# EAGLE design hotmetal (EAGLE 7.7.0)
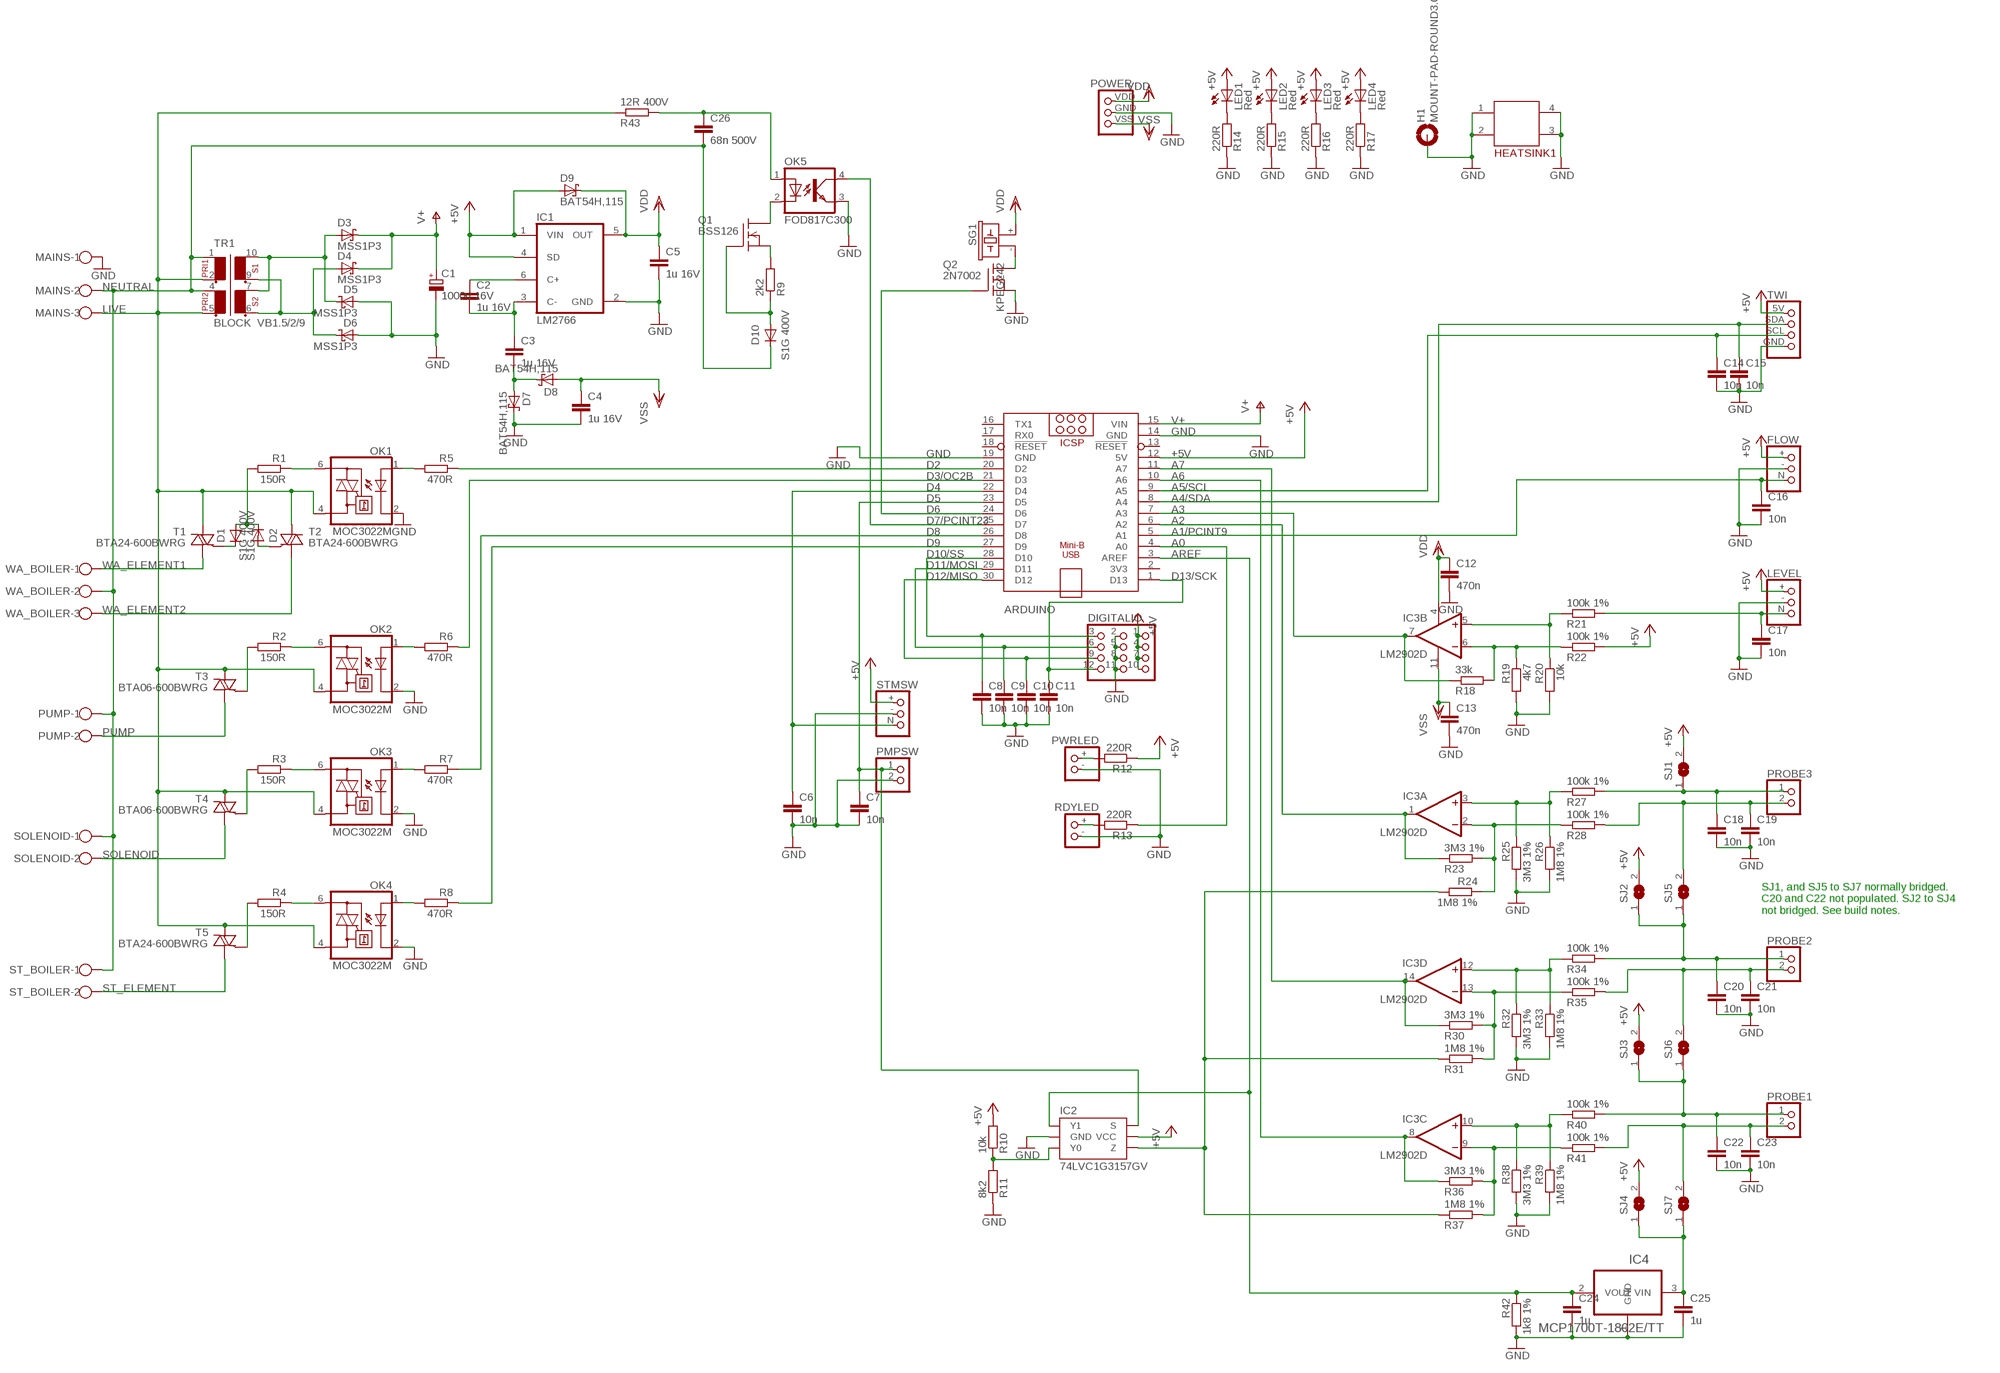
[diagram p0: schematic, sheet 1]

## Parts
ARDUINO  ARDUINO_NANO  [ARDUINO_NANO]
C1  1000u 16V  CPOL-EUE5-10.5  [E5-10,5]
C2  1u 16V  C-EUC0603K  [C0603K]
C3  1u 16V  C-EUC0603K  [C0603K]
C4  1u 16V  C-EUC0603K  [C0603K]
C5  1u 16V  C-EUC0603K  [C0603K]
C6  10n  C-EUC0603K  [C0603K]
C7  10n  C-EUC0603K  [C0603K]
C8  10n  C-EUC0603K  [C0603K]
C9  10n  C-EUC0603K  [C0603K]
C10  10n  C-EUC0603K  [C0603K]
C11  10n  C-EUC0603K  [C0603K]
C12  470n  C-EUC0603K  [C0603K]
C13  470n  C-EUC0603K  [C0603K]
C14  10n  C-EUC0603K  [C0603K]
C15  10n  C-EUC0603K  [C0603K]
C16  10n  C-EUC0603K  [C0603K]
C17  10n  C-EUC0603K  [C0603K]
C18  10n  C-EUC0603K  [C0603K]
C19  10n  C-EUC0603K  [C0603K]
C20  10n  C-EUC0603K  [C0603K]
C21  10n  C-EUC0603K  [C0603K]
C22  10n  C-EUC0603K  [C0603K]
C23  10n  C-EUC0603K  [C0603K]
C24  1u  C-EUC0603K  [C0603K]
C25  1u  C-EUC0603K  [C0603K]
C26  68n 500V  C-EUC1210K  [C1210K]
D1  S1G 400V  DIODE-DO214AC  [DO214AC]
D2  S1G 400V  DIODE-DO214AC  [DO214AC]
D3  MSS1P3  PD3S160  [POWERDI323]
D4  MSS1P3  PD3S160  [POWERDI323]
D5  MSS1P3  PD3S160  [POWERDI323]
D6  MSS1P3  PD3S160  [POWERDI323]
D7  BAT54H,115  [SOD123F]
D8  BAT54H,115  [SOD123F]
D9  BAT54H,115  [SOD123F]
D10  S1G 400V  DIODE-DO214AC  [DO214AC]
DIGITALIO  HDR4X3PWR  [HDR4X3PWR]
FLOW  HDR3PWR  [HDR3PWR]
H1  MOUNT-PAD-ROUND3.0  [3,0-PAD]
HEATSINK1  HOTMETALHEATSINK  [HOTMETALHEATSINK]
IC1  LM2766  [SOT23-6]
IC2  74LVC1G3157GV  [SOT457]
IC3  LM2902D  [SO14]
IC4  MCP1700T-1802E/TT  [SOT23]
LED1  Red  LEDSML0805  [SML0805]
LED2  Red  LEDSML0805  [SML0805]
LED3  Red  LEDSML0805  [SML0805]
LED4  Red  LEDSML0805  [SML0805]
LEVEL  HDR3PWR  [HDR3PWR]
MAINS  W237-103  [W237-103]
OK1  MOC3022M  [DIL06]
OK2  MOC3022M  [DIL06]
OK3  MOC3022M  [DIL06]
OK4  MOC3022M  [DIL06]
OK5  FOD817C300  PC817  [DIL04]
PMPSW  HDR2  [HDR2]
POWER  HDR3VDDVSS  [HDR2VDDVSS]
PROBE1  HDR2  [HDR2]
PROBE2  HDR2  [HDR2]
PROBE3  HDR2  [HDR2]
PUMP  W237-102  [W237-102]
PWRLED  HDR2PWR  [HDR2PWR]
Q1  BSS126  2N7002  [SOT23]
Q2  2N7002  [SOT23]
R1  150R  R-EU_0204/7  [0204/7]
R2  150R  R-EU_0204/7  [0204/7]
R3  150R  R-EU_0204/7  [0204/7]
R4  150R  R-EU_0204/7  [0204/7]
R5  470R  R-EU_R0805  [R0805]
R6  470R  R-EU_R0805  [R0805]
R7  470R  R-EU_R0805  [R0805]
R8  470R  R-EU_R0805  [R0805]
R9  2k2  R-EU_R0805  [R0805]
R10  10k  R-EU_R0805  [R0805]
R11  8k2  R-EU_R0805  [R0805]
R12  220R  R-EU_R0805  [R0805]
R13  220R  R-EU_R0805  [R0805]
R14  220R  R-EU_R0805  [R0805]
R15  220R  R-EU_R0805  [R0805]
R16  220R  R-EU_R0805  [R0805]
R17  220R  R-EU_R0805  [R0805]
R18  33k  R-EU_R0805  [R0805]
R19  4k7  R-EU_R0805  [R0805]
R20  10k  R-EU_R0805  [R0805]
R21  100k 1%  R-EU_R0805  [R0805]
R22  100k 1%  R-EU_R0805  [R0805]
R23  3M3 1%  R-EU_R0805  [R0805]
R24  1M8 1%  R-EU_R0805  [R0805]
R25  3M3 1%  R-EU_R0805  [R0805]
R26  1M8 1%  R-EU_R0805  [R0805]
R27  100k 1%  R-EU_R0805  [R0805]
R28  100k 1%  R-EU_R0805  [R0805]
R30  3M3 1%  R-EU_R0805  [R0805]
R31  1M8 1%  R-EU_R0805  [R0805]
R32  3M3 1%  R-EU_R0805  [R0805]
R33  1M8 1%  R-EU_R0805  [R0805]
R34  100k 1%  R-EU_R0805  [R0805]
R35  100k 1%  R-EU_R0805  [R0805]
R36  3M3 1%  R-EU_R0805  [R0805]
R37  1M8 1%  R-EU_R0805  [R0805]
R38  3M3 1%  R-EU_R0805  [R0805]
R39  1M8 1%  R-EU_R0805  [R0805]
R40  100k 1%  R-EU_R0805  [R0805]
R41  100k 1%  R-EU_R0805  [R0805]
R42  1k8 1%  R-EU_R0805  [R0805]
R43  12R 400V  R-EU_R0805  [R0805]
RDYLED  HDR2PWR  [HDR2PWR]
SG1  KPEG242  F/CM12P  [F/CM12P]
SJ1  SJ  [SJ]
SJ2  SJ  [SJ]
SJ3  SJ  [SJ]
SJ4  SJ  [SJ]
SJ5  SJ  [SJ]
SJ6  SJ  [SJ]
SJ7  SJ  [SJ]
SOLENOID  W237-102  [W237-102]
ST_BOILER  W237-102  [W237-102]
STMSW  HDR3PWR  [HDR3PWR]
T1  BTA24-600BWRG  BTA_TRIAC  [TO220FACEDOWN]
T2  BTA24-600BWRG  BTA_TRIAC  [TO220FACEDOWN]
T3  BTA06-600BWRG  BTA_TRIAC  [TO220FACEDOWN]
T4  BTA06-600BWRG  BTA_TRIAC  [TO220FACEDOWN]
T5  BTA24-600BWRG  BTA_TRIAC  [TO220FACEDOWN]
TR1  BLOCK VB1.5/2/9  TRAFO20X20MM2P2S  [T2P2S]
TWI  HDR4TWI  [HDR4TWI]
WA_BOILER  W237-103  [W237-103]

## Nets
+5V: ARDUINO.12(5V) D9.A DIGITALIO.1 DIGITALIO.4 DIGITALIO.7 DIGITALIO.10 FLOW.+ IC1.1(VIN) IC1.4(SD) IC2.5(VCC) LED1.A LED2.A LED3.A LED4.A LEVEL.+ R10.2 R12.1 R22.2 SJ1.2 SJ2.2 SJ3.2 SJ4.2 STMSW.+ TWI.5V
A0: ARDUINO.4(A0) R13.1
A1/PCINT9: ARDUINO.5(A1) C16.1 FLOW.N
A2: ARDUINO.6(A2) IC3.1(A:OUT) R23.1
A3: ARDUINO.7(A3) IC3.7(B:OUT) R18.1
A4/SDA: ARDUINO.8(A4) C15.1 TWI.SDA
A5/SCL: ARDUINO.9(A5) C14.1 TWI.SCL
A6: ARDUINO.10(A6) IC3.8(C:OUT) R36.1
A7: ARDUINO.11(A7) IC3.14(D:OUT) R30.1
AREF: ARDUINO.3(AREF) C24.1 IC2.1(Y1) IC4.2(VOUT) R42.1
D2: ARDUINO.20(D2) R5.1
D3/OC2B: ARDUINO.21(D3) R6.1
D4: ARDUINO.22(D4) C6.1 STMSW.N
D5: ARDUINO.23(D5) C7.1 IC2.6(S) PMPSW.1
D6: ARDUINO.24(D6) Q2.1(G)
D7/PCINT23: ARDUINO.25(D7) OK5.4(COL)
D8: ARDUINO.26(D8) R7.1
D9: ARDUINO.27(D9) R8.1
D10/SS: ARDUINO.28(D10) C8.1 DIGITALIO.3
D11/MOSI: ARDUINO.29(D11) C9.1 DIGITALIO.6
D12/MISO: ARDUINO.30(D12) C10.1 DIGITALIO.9
D13/SCK: ARDUINO.1(D13) C11.1 DIGITALIO.12
GND: ARDUINO.14(GND) ARDUINO.19(GND) C1.- C4.2 C5.2 C6.2 C7.2 C8.2 C9.2 C10.2 C11.2 C12.2 C13.2 C14.2 C15.2 C16.2 C17.2 C18.2 C19.2 C20.2 C21.2 C22.2 C23.2 C24.2 C25.2 D5.A D6.A D7.C DIGITALIO.2 DIGITALIO.5 DIGITALIO.8 DIGITALIO.11 FLOW.- H1.B3,0(MOUNT) HEATSINK1.1 HEATSINK1.2 HEATSINK1.3 HEATSINK1.4 IC1.2(GND) IC2.2(GND) IC4.1(GND) LEVEL.- MAINS.1 OK1.2(C) OK2.2(C) OK3.2(C) OK4.2(C) OK5.3(EMIT) PMPSW.2 POWER.GND PWRLED.- Q2.2(S) R11.1 R14.1 R15.1 R16.1 R17.1 R19.2 R20.2 R25.2 R26.2 R32.2 R33.2 R38.2 R39.2 R42.2 RDYLED.- STMSW.- TWI.GND
LIVE [power]: MAINS.3 OK1.4(A1) OK2.4(A1) OK3.4(A1) OK4.4(A1) R43.1 T1.T2(A2) T2.T2(A2) T3.T2(A2) T4.T2(A2) T5.T2(A2) TR1.2 TR1.5
N$1: OK3.1(A) R7.2
N$2: OK1.1(A) R5.2
N$3: OK4.1(A) R8.2
N$4 [power]: R3.2 T4.G
N$5 [power]: OK3.6(A2) R3.1
N$6 [power]: D1.A D2.C R1.2
N$7 [power]: R4.2 T5.G
N$8 [power]: OK4.6(A2) R4.1
N$9 [power]: OK1.6(A2) R1.1
N$10: C21.1 PROBE2.2 R35.2 SJ6.2
N$11: C22.1 PROBE1.1 R40.2 SJ3.1 SJ6.1
N$12: C20.1 PROBE2.1 R34.2 SJ2.1 SJ5.1
N$13: IC3.3(A:+IN) R25.1 R26.1 R27.1
N$14 [power]: D1.C T1.G
N$15 [power]: D2.A T2.G
N$16: C17.1 LEVEL.N R21.2
N$17: IC3.10(C:+IN) R38.1 R39.1 R40.1
N$18: IC3.9(C:-IN) R36.2 R37.2 R41.1
N$19: Q2.3(D) SG1.-
N$20: LED3.C R16.2
N$21: C2.1 IC1.6(C+)
N$22: OK2.1(A) R6.2
N$23 [power]: R2.2 T3.G
N$24 [power]: OK2.6(A2) R2.1
N$25: PWRLED.+ R12.2
N$26: R13.2 RDYLED.+
N$27: C2.2 C3.1 IC1.3(C-)
N$28: C23.1 PROBE1.2 R41.2 SJ7.2
N$29 [power]: C26.1 OK5.1(A) R43.2
N$30 [power]: D10.A Q1.1(G) R9.1
N$31: C19.1 PROBE3.2 R28.2 SJ5.2
N$32: C18.1 PROBE3.1 R27.2 SJ1.1
N$33: IC3.12(D:+IN) R32.1 R33.1 R34.1
N$34: IC3.2(A:-IN) R23.2 R24.1 R28.1
N$35: IC3.13(D:-IN) R30.2 R31.2 R35.1
N$36: IC3.5(B:+IN) R20.1 R21.1
N$37: IC2.3(Y0) R10.1 R11.2
N$38: IC2.4(Z) R24.2 R31.1 R37.1
N$39: D3.A D5.C TR1.7 TR1.10
N$40: IC3.6(B:-IN) R18.2 R19.1 R22.1
N$41: C25.1 IC4.3(VIN) SJ4.1 SJ7.1
N$42: LED1.C R14.2
N$43: LED2.C R15.2
N$44: LED4.C R17.2
N$45: D4.A D6.C TR1.6 TR1.9
N$46 [power]: Q1.2(S) R9.2
N$47 [power]: OK5.2(C) Q1.3(D)
N$49: C3.2 D7.A D8.C
NEUTRAL [power]: C26.2 D10.C MAINS.2 PUMP.1 SOLENOID.1 ST_BOILER.1 TR1.1 TR1.4 WA_BOILER.2
PUMP [power]: PUMP.2 T3.T1(A1)
SOLENOID [power]: SOLENOID.2 T4.T1(A1)
ST_ELEMENT [power]: ST_BOILER.2 T5.T1(A1)
V+: ARDUINO.15(VIN) C1.+ D3.C D4.C
VDD: C5.1 C12.1 D9.C IC1.5(OUT) IC3.4(P:V+) POWER.VDD SG1.+
VSS: C4.1 C13.1 D8.A IC3.11(P:V-) POWER.VSS
WA_ELEMENT1 [power]: T1.T1(A1) WA_BOILER.1
WA_ELEMENT2 [power]: T2.T1(A1) WA_BOILER.3
Unconnected: ARDUINO.2(3V3) ARDUINO.13(!RESET) ARDUINO.16(TX1) ARDUINO.17(RX0) ARDUINO.18(!RESET)

## Notes on the sheet
- SJ1, and SJ5 to SJ7 normally bridged.
  C20 and C22 not populated. SJ2 to SJ4
  not bridged. See build notes.

## Library data of the parts
ARDUINO = hotmetal:ARDUINO_NANO: Arduino Nano V3.0 Overview: The Arduino Nano is a small, complete, and breadboard-friendly board based on the ATmega328 (Arduino Nano 3.x) or ATmega168 (Arduino Nano 2.x). It has more or less the same functionality of the Arduino Duemilanove, but in a different package. It lacks only a DC power jack, and works with a Mini-B USB cable instead of a standard one. The Nano was designed and is being produced by Gravitech. Specifications: Microcontroller Atmel ATmega168 or ATmega328 Operating Voltage (logic level) 5 V Input Voltage (recommended) 7-12 V Input Voltage (limits) 6-20 V Digital I/O Pins 14 (of which 6 provide PWM output) Analog Input Pins 8 DC Current per I/O Pin 40 mA Flash Memory 16 KB (ATmega168) or 32 KB (ATmega328) of which 2 KB used by bootloader SRAM 1 KB (ATmega168) or 2 KB (ATmega328) EEPROM 512 bytes (ATmega168) or 1 KB (ATmega328) Clock Speed 16 MHz Dimensions 0.73" x 1.70" Length 45 mm Width 18 mm Weigth 5 g Power: The Arduino Nano can be powered via the Mini-B USB connection, 6-20V unregulated external power supply (pin 30), or 5V regulated external power supply (pin 27). The power source is automatically selected to the highest voltage source. Memory: The ATmega168 has 16 KB of flash memory for storing code (of which 2 KB is used for the bootloader); the ATmega328 has 32 KB, (also with 2 KB used for the bootloader). The ATmega168 has 1 KB of SRAM and 512 bytes of EEPROM (which can be read and written with the EEPROM library); the ATmega328 has 2 KB of SRAM and 1 KB of EEPROM. Input and Output: Each of the 14 digital pins on the Nano can be used as an input or output, using pinMode(), digitalWrite(), and digitalRead() functions. They operate at 5 volts. Each pin can provide or receive a maximum of 40 mA and has an internal pull-up resistor (disconnected by default) of 20-50 kOhms. In addition, some pins have specialized functions. Visit Arduino - ArduinoBoardNano <https://www.arduino.cc/en/Main/ArduinoBoardNano>
C1 = rcl:CPOL-EU: POLARIZED CAPACITOR, European symbol
C2-C26 = rcl:C-EU: CAPACITOR, European symbol
D1 D2 D10 = diode:DIODE-: DIODE
D3-D6 = diode:PD3S160: 1.0A SURFACE MOUNT SCHOTTKY BARRIER RECTIFIER POWERDI ® 323 Source: http://www.diodes.com/datasheets/ds30899.pdf
D7-D9 = hotmetal:BAT54H,115
DIGITALIO = hotmetal:HDR4X3PWR
FLOW LEVEL STMSW = hotmetal:HDR3PWR
H1 = holes:MOUNT-PAD-ROUND: MOUNTING PAD, round
HEATSINK1 = hotmetal:HOTMETALHEATSINK
IC1 = hotmetal:LM2766: Charge-pump VOLTAGE CONVERTER
IC2 = hotmetal:74LVC1G3157GV
IC3 = linear:LM2902: Low power quad operational amplifier Source: Data sgeet <http://www.st.com/internet/com/TECHNICAL_RESOURCES/TECHNICAL_LITERATURE/DATASHEET/CD00000533.pdf>
IC4 = hotmetal:MCP1700T-1802E/TT: Low Quiescent Current LDO
LED1-LED4 = led:LED: LED OSRAM: - CHIPLED LG R971, LG N971, LY N971, LG Q971, LY Q971, LO R971, LY R971 LH N974, LH R974 LS Q976, LO Q976, LY Q976 LO Q996 - Hyper CHIPLED LW Q18S LB Q993, LB Q99A, LB R99A - SideLED LS A670, LO A670, LY A670, LG A670, LP A670 LB A673, LV A673, LT A673, LW A673 LH A674 LY A675 LS A676, LA A676, LO A676, LY A676, LW A676 LS A679, LY A679, LG A679 - Hyper Micro SIDELED® LS Y876, LA Y876, LO Y876, LY Y876 LT Y87S - SmartLED LW L88C, LW L88S LB L89C, LB L89S, LG L890 LS L89K, LO L89K, LY L89K LS L896, LA L896, LO L896, LY L896 - TOPLED LS T670, LO T670, LY T670, LG T670, LP T670 LSG T670, LSP T670, LSY T670, LOP T670, LYG T670 LG T671, LOG T671, LSG T671 LB T673, LV T673, LT T673, LW T673 LH T674 LS T676, LA T676, LO T676, LY T676, LB T676, LH T676, LSB T676, LW T676 LB T67C, LV T67C, LT T67C, LS T67K, LO T67K, LY T67K, LW E67C LS E67B, LA E67B, LO E67B, LY E67B, LB E67C, LV E67C, LT E67C LW T67C LS T679, LY T679, LG T679 LS T770, LO T770, LY T770, LG T770, LP T770 LB T773, LV T773, LT T773, LW T773 LH T774 LS E675, LA E675, LY E675, LS T675 LS T776, LA T776, LO T776, LY T776, LB T776 LHGB T686 LT T68C, LB T68C - Hyper Mini TOPLED® LB M676 - Mini TOPLED Santana® LG M470 LS M47K, LO M47K, LY M47K Source: http://www.osram.convergy.de LUXEON: - LUMILED® LXK2-PW12-R00, LXK2-PW12-S00, LXK2-PW14-U00, LXK2-PW14-V00 LXK2-PM12-R00, LXK2-PM12-S00, LXK2-PM14-U00 LXK2-PE12-Q00, LXK2-PE12-R00, LXK2-PE12-S00, LXK2-PE14-T00, LXK2-PE14-U00 LXK2-PB12-K00, LXK2-PB12-L00, LXK2-PB12-M00, LXK2-PB14-N00, LXK2-PB14-P00, LXK2-PB14-Q00 LXK2-PR12-L00, LXK2-PR12-M00, LXK2-PR14-Q00, LXK2-PR14-R00 LXK2-PD12-Q00, LXK2-PD12-R00, LXK2-PD12-S00 LXK2-PH12-R00, LXK2-PH12-S00 LXK2-PL12-P00, LXK2-PL12-Q00, LXK2-PL12-R00 Source: www.luxeon.com KINGBRIGHT: KA-3528ASYC Source: www.kingbright.com
MAINS WA_BOILER = con-wago-500:W237-103: WAGO SCREW CLAMP; MPN: 237-103; OC_FARNELL: unknown; OC_NEWARK: 18M7116
OK1-OK4 = optocoupler:MOC30*M: RANDOM-PHASE OPTOISOLATORS TRIAC DRIVER OUTPUT Source: http://www.fairchildsemi.com MOC3020-M.pdf; MF: FAIRCHILD SEMICONDUCTOR; MPN: MOC3022-M; OC_FARNELL: 1021086; OC_NEWARK: 58K1956
OK5 = optocoupler:PC817: SHARP OPTO COUPLER; MPN: PC817X4J000F; OC_FARNELL: 9707727; OC_NEWARK: 97K7059
PMPSW PROBE1-PROBE3 = hotmetal:HDR2
POWER = hotmetal:HDR3VDDVSS
PUMP SOLENOID ST_BOILER = con-wago-500:W237-102: WAGO SCREW CLAMP; MPN: 237-102; OC_FARNELL: unknown; OC_NEWARK: 70K9898
PWRLED RDYLED = hotmetal:HDR2PWR
Q1 Q2 = hotmetal:2N7002
R1-R28 R30-R43 = rcl:R-EU_: RESISTOR, European symbol
SG1 = buzzer:F/CM12P: BUZZER Source: Buerklin; OC_FARNELL: unknown; OC_NEWARK: unknown
SJ1-SJ7 = jumper:SJ: SMD solder JUMPER
T1-T5 = hotmetal:BTA_TRIAC
TR1 = hotmetal:TRAFO20X20MM2P2S: TRANSFORMER 2 primary windings, 2 secondary windings Based on the EI30-2 device in trafo.lbr but with two primary windings. This means in the USA a 2x115 primary winding tansformer can be used in parallel. In the UK we use a single primary winding. The pinouts are compatible.
TWI = hotmetal:HDR4TWI

## Net classes
1 power: drill 0.041 mm

## Board
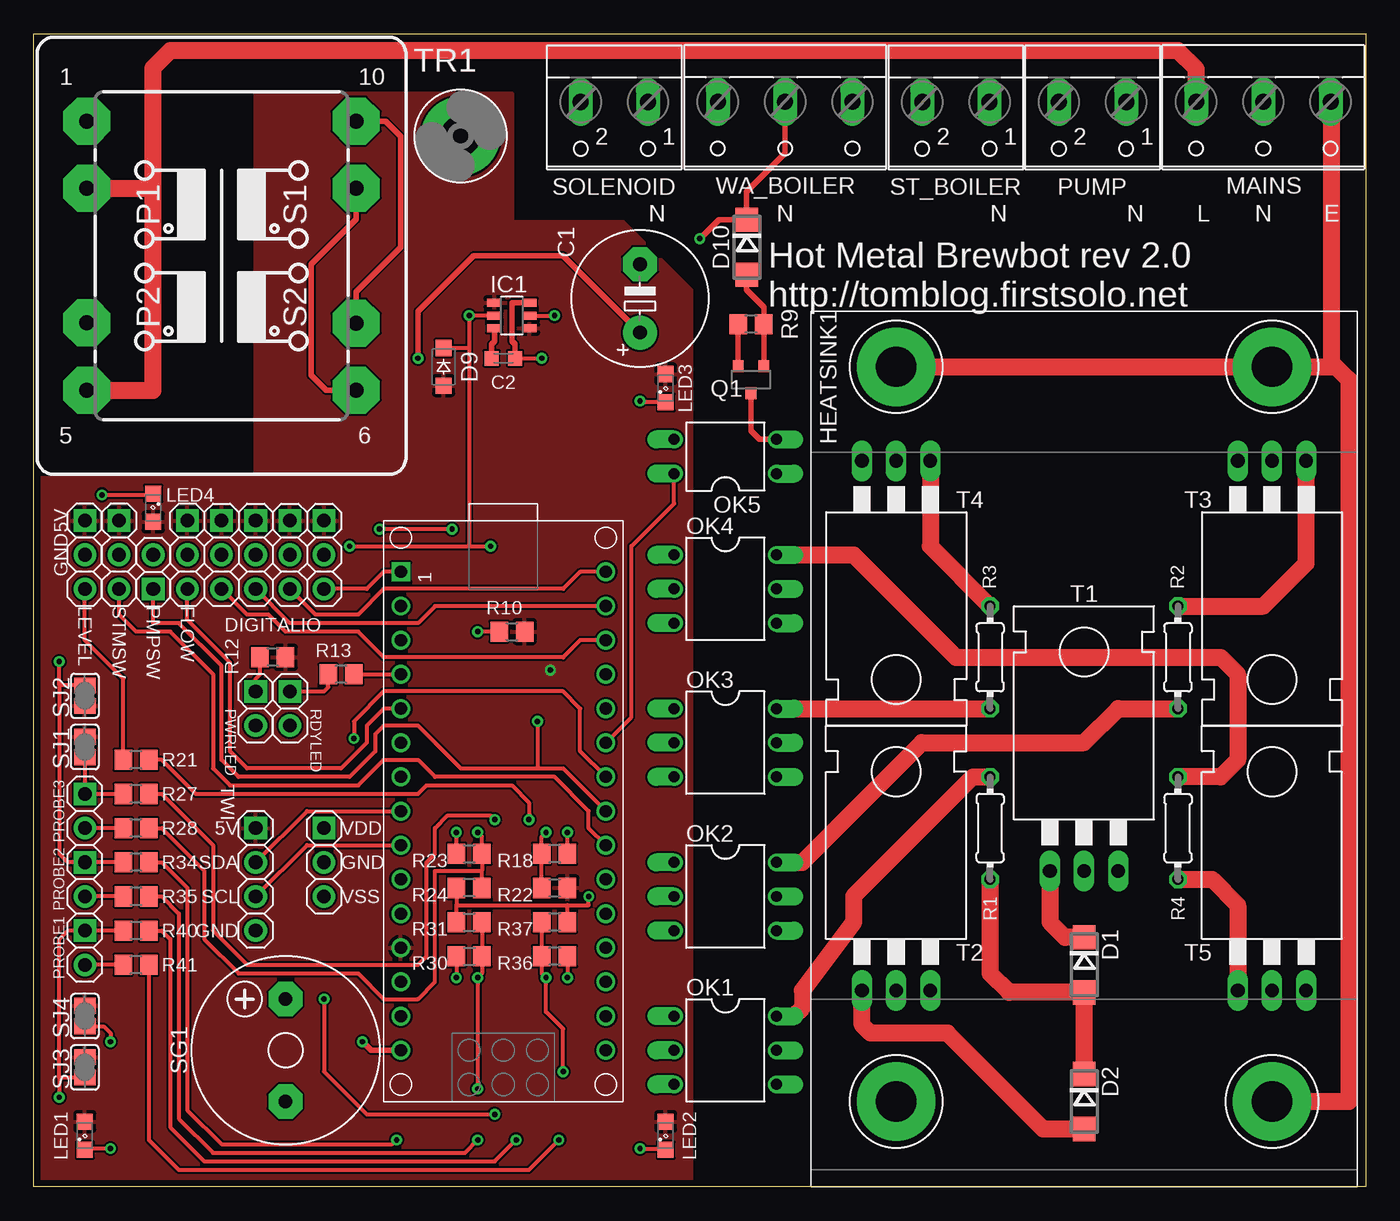
[diagram p1: board, top side]
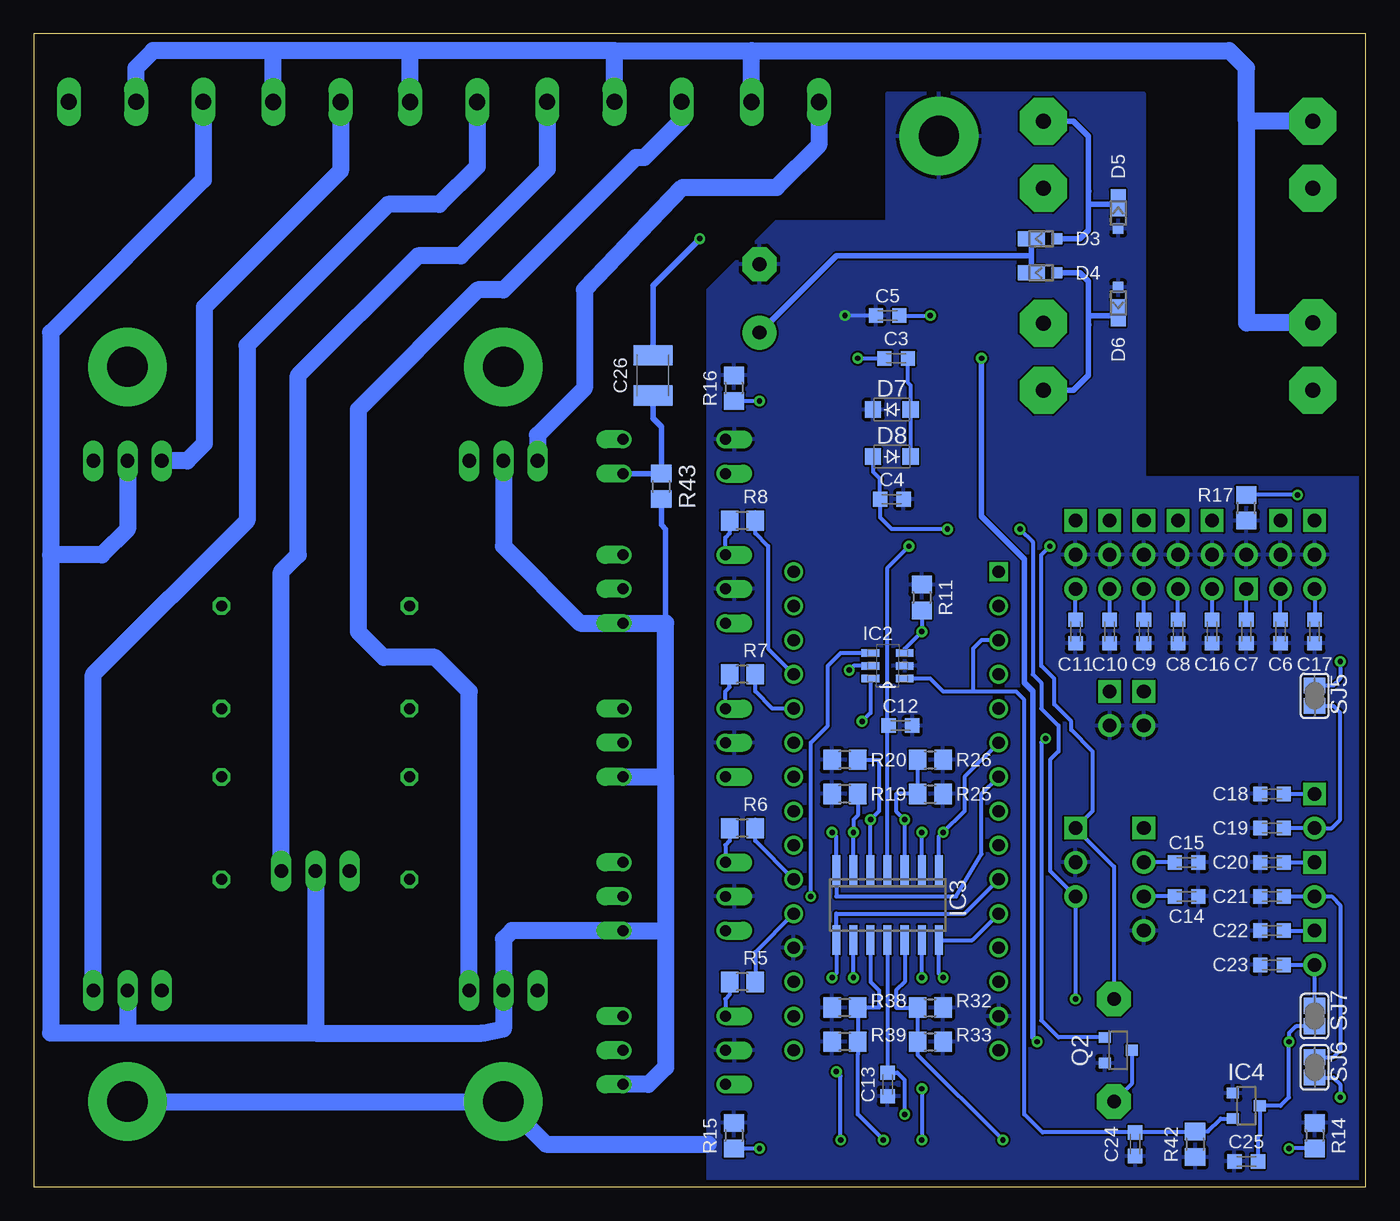
[diagram p2: board, bottom side, seen from below]

Size 99.06 x 85.72 mm. Coordinates in mm from the lower left corner, seen from the top.
Outline: 99.06,85.72 99.06,0 0,0 0,85.72 99.06,85.72
Copper layers (1*16): Top 0.035mm / dielectric 1.5mm / Bottom 0.035mm
Design rules "coffiepidshield *": minimum track width 6mil, minimum drill 0.3mm, track to track 6mil, track to pad 10mil, pad to pad 6mil, via to via 8mil, smd to smd 6mil, copper to edge 20mil, drill to drill 20mil, minimum pad ring 10mil, minimum via ring 8mil, stop-mask expansion 6mil, vias tented up to drill 0mil, thermal gap 10mil
tKeepout: area 5.1,0 to 11.4,15.2
bKeepout: area 71.1,0 to 78.7,20.3; area 20.3,0 to 27.9,20.3

### Footprints (pad centres in the part's own frame; a part is rotated, then mirrored left to right if it is on the bottom)
ARDUINO_NANO = drill 0.9 square: 1 -20.32,-7.62 | drill 0.9: 2 -17.78,-7.62; 3 -15.24,-7.62; 4 -12.7,-7.62; 5 -10.16,-7.62; 6 -7.62,-7.62; 7 -5.08,-7.62; 8 -2.54,-7.62; 9 0,-7.62; 10 2.54,-7.62; 11 5.08,-7.62; 12 7.62,-7.62; 13 10.16,-7.62; 14 12.7,-7.62; 15 15.24,-7.62; 16 15.24,7.62; 17 12.7,7.62; 18 10.16,7.62; 19 7.62,7.62; 20 5.08,7.62; 21 2.54,7.62; 22 0,7.62; 23 -2.54,7.62; 24 -5.08,7.62; 25 -7.62,7.62; 26 -10.16,7.62; 27 -12.7,7.62; 28 -15.24,7.62; 29 -17.78,7.62; 30 -20.32,7.62
E5-10,5 = drill 1.016 pad 2.54: + -2.54,0 | drill 1.016 pad 2.54 octagon: - 2.54,0
C0603K = smd 1.05 x 1.08: 1 -0.875,0; 2 0.875,0
C1210K = smd 1.5 x 2.9: 1 -1.5,0; 2 1.5,0
DO214AC = smd 1.8 x 1.7: A 2.05,0; C -2.05,0
POWERDI323 = smd 0.8 x 0.8: A 1.15,0 | smd 2 x 1.1: C -0.75,0
SOD123F = smd 1.2 x 1.2: A 1.4,0; C -1.4,0
HDR4X3PWR = drill 1.016 pad 1.676 square: 1 -3.81,1.27; 4 -1.27,1.27; 7 1.27,1.27; 10 3.81,1.27 | drill 1.016 pad 1.676: 2 -3.81,-1.27; 3 -3.81,-3.81; 5 -1.27,-1.27; 6 -1.27,-3.81; 8 1.27,-1.27; 9 1.27,-3.81; 11 3.81,-1.27; 12 3.81,-3.81
HDR3PWR = drill 1.016 pad 1.676 square: + -2.54,0 | drill 1.016 pad 1.676: - 0,0; N 2.54,0
3,0-PAD = drill 3 pad 5.842: B3,0 0,0
HOTMETALHEATSINK = drill 3 pad 5.842: 1 -13.97,27.94; 2 -13.97,-26.67; 3 13.97,-26.67; 4 13.97,27.94
SOT23-6 = smd 0.6 x 1.1: 1 -0.95,-1.3; 2 0,-1.3; 3 0.95,-1.3; 4 0.95,1.3; 5 0,1.3; 6 -0.95,1.3
SOT457 = smd 1.321 x 0.559: 1 -1.27,0.94; 2 -1.27,0; 3 -1.27,-0.94; 4 1.27,-0.94; 5 1.27,0; 6 1.27,0.94
SO14 = smd 0.6 x 2.2: 1 -3.81,-2.6; 2 -2.54,-2.6; 3 -1.27,-2.6; 4 0,-2.6; 5 1.27,-2.6; 6 2.54,-2.6; 7 3.81,-2.6; 8 3.81,2.6; 9 2.54,2.6; 10 1.27,2.6; 11 0,2.6; 12 -1.27,2.6; 13 -2.54,2.6; 14 -3.81,2.6
SOT23 = smd 0.8 x 0.9: 1 -0.95,-1; 2 0.95,-1; 3 0,1
SML0805 = smd 1.2 x 1.2: A 1.05,0; C -1.05,0
W237-103 = drill 1.194 long: 1 -5,-1.29; 2 0,-1.29; 3 5,-1.29
DIL06 = drill 0.813 offset: 1 -2.54,-3.81; 2 0,-3.81; 3 2.54,-3.81; 4 2.54,3.81; 5 0,3.81; 6 -2.54,3.81
DIL04 = drill 0.813 offset: 1 -1.27,-3.81; 2 1.27,-3.81; 3 1.27,3.81; 4 -1.27,3.81
HDR2 = drill 1.016 pad 1.676 square: 1 -1.27,0 | drill 1.016 pad 1.676: 2 1.27,0
HDR2VDDVSS = drill 1.016 pad 1.676: GND 1.27,0; VSS 3.81,0 | drill 1.016 pad 1.676 square: VDD -1.27,0
W237-102 = drill 1.194 long: 1 -2.5,-1.27; 2 2.5,-1.27
HDR2PWR = drill 1.016 pad 1.676 square: + -1.27,0 | drill 1.016 pad 1.676: - 1.27,0
0204/7 = drill 0.813 octagon: 1 -3.81,0; 2 3.81,0
R0805 = smd 1.3 x 1.5: 1 -0.95,0; 2 0.95,0
F/CM12P = drill 1.016 pad 2.54 octagon: + 3.81,0; - -3.81,0
SJ = smd 1.168 x 1.6: 1 -0.762,0; 2 0.762,0
TO220FACEDOWN = drill 1.016 long: G -2.54,-10.16; T1 2.54,-10.16; T2 0,-10.16
T2P2S = drill 1.118 pad 3.5 octagon: 1 -10.008,10.008; 2 -10.008,5.008; 4 -10.008,-4.992; 5 -10.008,-10.008; 6 10.008,-10.008; 7 10.008,-5.004; 9 10.008,5.004; 10 10.008,10.008
HDR4TWI = drill 1.016 pad 1.676 square: 5V -3.81,0 | drill 1.016 pad 1.676: GND 3.81,0; SCL 1.27,0; SDA -1.27,0

### Placement (x,y rotation side)
ARDUINO  34.92,25.4 270 top
C1  45.09,66.04 90 top
C2  34.92,61.59 0 top
C3  34.92,61.59 0 bottom
C4  35.24,51.12 0 bottom
C5  35.56,64.77 180 bottom
C6  6.35,41.27 270 bottom
C7  8.89,41.27 270 bottom
C8  13.97,41.27 270 bottom
C9  16.51,41.27 270 bottom
C10  19.05,41.27 270 bottom
C11  21.59,41.27 270 bottom
C12  34.61,34.29 0 bottom
C13  35.56,7.62 270 bottom
C14  13.34,21.59 0 bottom
C15  13.34,24.13 0 bottom
C16  11.43,41.27 270 bottom
C17  3.81,41.27 270 bottom
C18  6.99,29.21 180 bottom
C19  6.99,26.67 180 bottom
C20  6.99,24.13 180 bottom
C21  6.99,21.59 180 bottom
C22  6.99,19.05 180 bottom
C23  6.99,16.51 180 bottom
C24  17.14,3.17 270 bottom
C25  8.89,1.91 180 bottom
C26  53.02,60.33 90 bottom
D1  78.11,16.51 270 top
D2  78.11,6.35 270 top
D3  24.13,70.48 0 bottom
D4  24.13,67.94 0 bottom
D5  18.41,72.39 270 bottom
D6  18.41,65.72 90 bottom
D7  35.24,57.78 0 bottom
D8  35.24,54.29 180 bottom
D9  30.48,60.96 270 top
D10  53.02,69.85 270 top
DIGITALIO  17.78,48.26 0 top
FLOW  11.43,46.99 270 top
H1  31.75,78.11 0 top
HEATSINK1  78.11,33.02 0 top
IC1  35.56,64.77 90 top
IC2  35.56,38.73 180 bottom
IC3  35.56,20.95 180 bottom
IC4  8.89,6.03 270 bottom
LED1  3.81,3.81 90 top
LED2  46.99,3.81 90 top
LED3  46.99,59.37 90 top
LED4  8.89,50.48 270 top
LEVEL  3.81,46.99 270 top
MAINS  91.44,79.38 180 top
OK1  51.44,10.16 270 top
OK2  51.44,21.59 270 top
OK3  51.44,33.02 270 top
OK4  51.44,44.45 270 top
OK5  51.44,54.29 90 top
PMPSW  8.89,45.72 90 top
POWER  21.59,25.4 270 top
PROBE1  3.81,17.78 270 top
PROBE2  3.81,22.86 270 top
PROBE3  3.81,27.94 270 top
PUMP  78.74,79.38 180 top
PWRLED  16.51,35.56 270 top
Q1  53.34,60.01 180 top
Q2  18.41,10.16 270 bottom
R1  71.12,26.67 270 top
R2  85.09,39.37 90 top
R3  71.12,39.37 90 top
R4  85.09,26.67 270 top
R5  46.35,15.24 180 bottom
R6  46.35,26.67 180 bottom
R7  46.35,38.1 180 bottom
R8  46.35,49.53 180 bottom
R9  53.34,64.14 180 top
R10  35.56,41.27 0 top
R11  33.02,43.81 270 bottom
R12  17.78,39.37 180 top
R13  22.86,38.1 180 top
R14  3.81,3.81 270 bottom
R15  46.99,3.81 270 bottom
R16  46.99,59.37 270 bottom
R17  8.89,50.48 90 bottom
R18  38.73,24.77 180 top
R19  38.73,29.21 180 bottom
R20  38.73,31.75 180 bottom
R21  7.62,31.75 180 top
R22  38.73,22.23 0 top
R23  32.38,24.77 0 top
R24  32.38,22.23 180 top
R25  32.38,29.21 0 bottom
R26  32.38,31.75 0 bottom
R27  7.62,29.21 180 top
R28  7.62,26.67 180 top
R30  32.38,17.14 0 top
R31  32.38,19.68 0 top
R32  32.38,13.34 0 bottom
R33  32.38,10.79 0 bottom
R34  7.62,24.13 180 top
R35  7.62,21.59 180 top
R36  38.73,17.14 180 top
R37  38.73,19.68 180 top
R38  38.73,13.34 180 bottom
R39  38.73,10.79 180 bottom
R40  7.62,19.05 180 top
R41  7.62,16.51 180 top
R42  12.7,3.17 270 bottom
R43  52.39,52.07 90 bottom
RDYLED  19.05,35.56 270 top
SG1  18.73,10.16 90 top
SJ1  3.81,32.7 90 top
SJ2  3.81,36.51 270 top
SJ3  3.81,8.89 90 top
SJ4  3.81,12.7 90 top
SJ5  3.81,36.51 270 bottom
SJ6  3.81,8.89 90 bottom
SJ7  3.81,12.7 90 bottom
SOLENOID  43.18,79.38 180 top
ST_BOILER  68.58,79.38 180 top
STMSW  6.35,46.99 270 top
T1  78.11,33.66 0 top
T2  64.14,24.77 0 top
T3  92.08,43.81 180 top
T4  64.14,43.81 180 top
T5  92.08,24.77 0 top
TR1  13.97,69.22 0 top
TWI  16.51,22.86 270 top
WA_BOILER  55.88,79.38 180 top

### Tracks (layer width: path | path; a pad name or v marks a point on that pad's centre or on a via)
+5V  (via drill 0.4 pad 0.5)
  Bottom 0.305: IC2.5 38.1,38.73 v38.42,38.42
  pour Top (isolate 0.152): 48.9,0 0,0 0,52.7 16.51,52.7 16.51,81.28 35.56,81.28 35.56,71.75 43.81,71.75 48.9,66.67
A0
  Top 0.305: R13.1 ARDUINO.4
A1/PCINT9
  Top 0.305: ARDUINO.5 26.04,35.56 24.77,34.29 24.77,33.02 22.86,31.11 15.88,31.11 14.61,32.38 14.61,38.98 C16.1 FLOW.N
  Bottom 0.305: C16.1 FLOW.N
A2  (via drill 0.4)
  Top 0.305: v31.43,26.35 R23.1
  Bottom 0.305: IC3.1 31.75,26.04 v31.43,26.35 29.84,27.94 29.84,30.48 ARDUINO.6
A3  (via drill 0.4)
  Top 0.305: R18.1 v39.69,26.35
  Bottom 0.305: ARDUINO.7 28.57,29.21 28.57,24.77 30.48,21.59 39.37,21.59 IC3.7 39.37,26.04 v39.69,26.35
A4/SDA
  Top 0.305: ARDUINO.8 20.32,27.94 TWI.SDA
  Bottom 0.305: C15.1 TWI.SDA
A5/SCL
  Top 0.305: TWI.SCL 20.32,25.4 ARDUINO.9
  Bottom 0.305: C14.1 TWI.SCL
A6  (via drill 0.4)
  Top 0.305: R36.1 v39.69,15.56
  Bottom 0.305: ARDUINO.10 29.84,20.32 39.37,20.32 IC3.8 39.37,15.88 v39.69,15.56
A7  (via drill 0.4)
  Top 0.305: R30.1 v31.43,15.56
  Bottom 0.305: ARDUINO.11 29.27,18.36 IC3.14 31.75,15.88 v31.43,15.56
AREF
  Bottom 0.305: R42.1 | ARDUINO.3 28.57,40.64 29.21,40.01 29.21,36.83 | 29.21,36.83 31.43,36.83 32.4,37.8 IC2.1 | 29.21,36.83 26.04,36.83 25.4,36.2 25.4,5.4 24.05,4.05 C24.1 12.78,4.05 R42.1 | IC4.2 10.79,5.08 11.73,4.14 12.69,4.14 R42.1
D2
  Bottom 0.305: ARDUINO.20 45.4,17.46 45.4,15.88 R5.1
D3/OC2B
  Bottom 0.305: ARDUINO.21 45.4,25.72 45.4,27.3 R6.1
D4
  Top 0.305: ARDUINO.22 41.27,26.67 41.27,27.94 38.73,30.48 29.84,30.48 28.57,31.75 26.04,31.75 24.13,29.84 14.61,29.84 13.34,31.11 13.34,38.1 10.16,41.27 7.62,41.27 6.35,42.55 STMSW.N
  Bottom 0.305: C6.1 STMSW.N
D5  (via drill 0.4 pad 0.5)
  Top 0.305: ARDUINO.23 39.37,31.11 37.47,31.11 | PMPSW.1 8.89,41.91 10.79,41.91 13.97,38.73 13.97,31.75 15.24,30.48 23.5,30.48 25.4,32.38 25.4,33.66 26.04,34.29 28.57,34.29 31.75,31.11 37.47,31.11 | v37.47,34.61 37.47,31.11
  Bottom 0.305: IC2.6 36.83,35.24 v37.47,34.61 | C7.1 PMPSW.1
D6  (via drill 0.4)
  Top 0.305: ARDUINO.24 40.64,32.38 40.64,35.56 39.37,36.83 26.04,36.83 23.81,34.61 v23.81,33.34
  Bottom 0.305: v23.81,33.34 24.13,33.02 24.13,12.38 22.86,11.11 Q2.1
D7/PCINT23
  Top 0.305: ARDUINO.25 44.45,34.92 44.45,47.62 47.62,50.8 OK5.4
D8
  Bottom 0.305: ARDUINO.26 44.13,35.56 45.4,36.83 45.4,38.73 R7.1
D9
  Bottom 0.305: R8.1 45.4,50.16 45.4,48.58 44.45,47.62 44.45,40.01 ARDUINO.27
D10/SS
  Top 0.305: ARDUINO.28 40.64,40.64 39.37,39.37 26.04,39.37 24.13,41.27 18.73,41.27 17.46,42.55 15.88,42.55 DIGITALIO.3
  Bottom 0.305: C8.1 DIGITALIO.3
D11/MOSI
  Top 0.305: ARDUINO.29 29.84,43.18 28.57,41.91 19.05,41.91 DIGITALIO.6
  Bottom 0.305: C9.1 DIGITALIO.6
D12/MISO
  Top 0.305: ARDUINO.30 40.64,45.72 39.37,44.45 26.04,44.45 24.13,42.55 20.95,42.55 DIGITALIO.9
  Bottom 0.305: C10.1 DIGITALIO.9
D13/SCK
  Top 0.305: ARDUINO.1 26.04,45.72 24.77,44.45 DIGITALIO.12
  Bottom 0.305: C11.1 DIGITALIO.12
GND  (via drill 0.4)
  Top 0.305: IC1.2 v38.73,64.77
  Top 1.27: 96.52,60.96 96.52,80.58 MAINS.1 | HEATSINK1.1 HEATSINK1.4 96.52,60.96 | 96.52,60.96 96.84,60.96 97.79,60.01 97.79,6.35 HEATSINK1.3
  Bottom 0.305: C5.2 v38.73,64.77
  Bottom 1.27: HEATSINK1.3 HEATSINK1.2 60.96,3.17 48.9,3.17
  pour Bottom (isolate 0.152): 43.81,71.75 35.56,71.75 35.56,81.28 16.51,81.28 16.51,52.7 0,52.7 0,0 48.9,0 48.9,66.67
LIVE
  Top 1.27: MAINS.3 86.44,83.11 85.09,84.45 10.16,84.45 8.89,83.19 8.89,74.22 | 8.89,74.22 8.89,59.21 TR1.5 | TR1.2 8.89,74.22
  Bottom 0.406: R43.1 52.39,49.21 52.07,48.9 52.07,41.91
  Bottom 1.27: MAINS.3 86.44,74.85 97.79,63.5 97.79,46.99 | 97.79,46.99 97.79,11.43 92.08,11.43 | T3.T2 92.08,48.9 93.98,46.99 97.79,46.99 | T5.T2 92.08,11.43 | T1.T2 78.11,11.43 | 78.11,11.43 65.72,11.43 64.14,11.75 T2.T2 64.14,18.41 63.5,19.05 OK2.4 52.07,19.05 | 52.07,30.48 52.07,41.91 OK4.4 58.42,41.91 64.14,47.62 T4.T2 | OK3.4 52.07,30.48 | 52.07,30.48 52.07,19.05 | 52.07,19.05 52.07,8.89 53.34,7.62 OK1.4 | 78.11,11.43 92.08,11.43
N$1
  Bottom 0.305: OK3.1 47.62,36.83 47.31,37.15 47.31,38.73 R7.2
N$2
  Bottom 0.305: OK1.1 47.62,13.97 47.3,14.29 R5.2
N$3
  Bottom 0.305: OK4.1 47.62,48.26 47.3,48.58 R8.2
N$4
  Top 1.27: T4.G 66.67,47.62 R3.2
N$5
  Top 1.27: OK3.6 R3.1
N$6
  Top 1.27: D2.C D1.A 72.53,14.46 71.12,15.88 R1.2
N$7
  Top 1.27: R4.2 87.63,22.86 89.53,20.95 T5.G
N$8
  Top 1.27: OK4.6 60.96,46.99 68.58,39.37 88.27,39.37 89.53,38.1 89.53,31.75 88.27,30.48 R4.1
N$9
  Top 1.27: R1.1 69.85,30.48 60.96,21.59 60.96,19.68 57.15,14.61 57.15,13.34 56.52,12.7 OK1.6
N$10
  Top 0.305: R35.2 PROBE2.2
  Bottom 0.305: C21.1 PROBE2.2 2.54,21.59 1.91,20.95 1.91,10.16 2.41,9.65 SJ6.2
N$11  (via drill 0.4)
  Top 0.305: R40.2 PROBE1.1 2.54,19.05 1.91,18.41 1.91,8.13 | SJ3.1 1.91,8.13 | 1.91,8.13 v1.91,6.67
  Bottom 0.305: SJ3.1 2.41,8.13 1.91,7.62 v1.91,6.67 | C22.1 PROBE1.1
N$12  (via drill 0.4)
  Top 0.305: R34.2 PROBE2.1 2.54,24.13 1.91,24.77 1.91,37.27 | SJ2.1 1.91,37.27 | 1.91,37.27 v1.91,39.05
  Bottom 0.305: C20.1 PROBE2.1 | v1.91,39.05 1.91,37.78 2.41,37.27 SJ2.1
N$13  (via drill 0.4)
  Top 0.305: R27.1 9.53,29.21 13.34,25.4 13.34,19.05 15.88,16.51 28.57,16.51 29.21,17.14 29.21,24.13 29.84,24.77 29.84,26.67 30.8,27.62 33.97,27.62 v34.29,27.3
  Bottom 0.305: R26.1 R25.1 34.92,29.21 34.92,27.94 v34.29,27.3 IC3.3
N$14
  Top 1.27: T1.G 75.56,19.68 76.69,18.56 D1.C
N$15
  Top 1.27: T2.G 61.59,12.06 62.23,11.43 67.94,11.43 75.08,4.3 D2.A
N$16
  Top 0.305: LEVEL.N 3.81,40.64 6.67,37.78 R21.2
  Bottom 0.305: LEVEL.N C17.1
N$17  (via drill 0.4 pad 0.5)
  Top 0.305: R40.1 9.53,19.05 10.16,18.41 10.16,4.45 12.7,1.91 34.29,1.91 v35.88,3.49
  Bottom 0.305: IC3.10 36.83,15.24 36.2,14.61 36.2,13.34 R38.1 R39.1 37.78,9.85 37.78,9.84 37.78,5.4 v35.88,3.49
N$18  (via drill 0.4, 0.4 pad 0.5)
  Top 0.305: R37.2 R36.2 37.78,15.87 v38.1,15.56 38.1,13.02 39.37,11.75 v39.37,8.57 | v39.05,3.49 36.83,1.27 10.79,1.27 8.57,3.5 R41.1
  Bottom 0.305: v38.1,15.56 IC3.9 | v39.05,3.49 39.05,8.26 v39.37,8.57
N$19
  Bottom 0.305: Q2.3 17.41,7.67 SG1.-
N$20  (via drill 0.4)
  Top 0.305: LED3.C 45.18,58.32 v45.09,58.42
  Bottom 0.305: R16.2 v45.09,58.42
N$21
  Top 0.406: IC1.6 34.29,63.79 34.29,62.87 34.05,62.62 C2.1
N$22
  Bottom 0.305: OK2.1 47.62,25.4 47.3,25.72 R6.2
N$23
  Top 1.27: R2.2 91.44,43.18 94.61,46.35 T3.G
N$24
  Top 1.27: OK2.6 57.15,24.13 66.04,33.02 78.11,33.02 80.64,35.56 R2.1
N$25
  Top 0.305: PWRLED.+ 16.51,37.78 16.83,38.1 R12.2
N$26
  Top 0.305: RDYLED.+ 21.59,36.83 21.91,37.15 R13.2
N$27  (via drill 0.4)
  Top 0.305: C3.1 v37.78,61.59
  Top 0.406: IC1.3 35.56,65.72 35.56,62.87 35.8,62.62 C3.1
  Bottom 0.305: v37.78,61.59 C3.1
N$28
  Top 0.305: R41.2 PROBE1.2
  Bottom 0.305: 6.03,16.43 C23.1 PROBE1.2 SJ7.2
N$29
  Bottom 0.406: OK5.1 R43.2 52.39,56.52 53.02,57.15 C26.1
N$30
  Top 0.406: Q1.1 R9.1 54.29,65.41 53.02,66.67 D10.A
N$31
  Top 0.305: R28.2 PROBE3.2
  Bottom 0.305: C19.1 PROBE3.2 2.54,26.67 1.91,27.3 1.91,35.24 2.41,35.75 SJ5.2
N$32
  Top 0.305: R27.2 PROBE3.1 SJ1.1
  Bottom 0.305: C18.1 PROBE3.1
N$33  (via drill 0.4)
  Top 0.305: R34.1 9.53,24.13 11.43,22.23 11.43,5.71 13.97,3.17 26.67,3.17 v26.99,3.49
  Bottom 0.305: IC3.12 34.29,15.24 34.92,14.61 34.92,13.34 R32.1 R33.1 33.34,9.84 v26.99,3.49
N$34  (via drill 0.4)
  Top 0.305: v33.02,26.35 33.34,26.04 R23.2 33.34,23.5 | R24.1 33.34,23.5 | 33.34,23.5 29.84,23.5 29.84,15.24 28.57,13.97 26.04,13.97 24.13,15.88 15.24,15.88 12.7,18.41 12.7,23.5 9.53,26.67 R28.1
  Bottom 0.305: IC3.2 v33.02,26.35
N$35  (via drill 0.4)
  Top 0.305: R31.2 R30.2 33.34,15.87 v33.02,15.56 v33.02,7.3 | R35.1 9.53,21.59 10.79,20.32 10.79,5.08 13.34,2.54 32.07,2.54 v33.02,3.49
  Bottom 0.305: v33.02,15.56 IC3.13 | v33.02,7.3 v33.02,3.49
N$36  (via drill 0.4 pad 0.5)
  Top 0.305: v36.83,27.3 36.83,28.57 35.56,29.84 29.21,29.84 28.57,29.21 12.06,29.21 9.53,31.75 R21.1
  Bottom 0.305: IC3.5 v36.83,27.3 36.2,27.94 36.2,31.75 R20.1
N$37  (via drill 0.4 pad 0.5)
  Top 0.305: R10.1 v33.02,41.27
  Bottom 0.305: IC2.3 34.29,40.01 v33.02,41.27 R11.2
N$38  (via drill 0.4 pad 0.5)
  Top 0.305: R24.2 31.43,20.95 | 31.43,20.95 39.69,20.95 | 39.69,20.95 41.27,20.95 v41.27,21.59 | R37.1 39.69,20.95 | R31.1 31.43,20.95
  Bottom 0.305: v41.27,21.59 41.27,33.02 40.01,34.29 40.01,38.73 39.06,39.67 IC2.4
N$39
  Top 0.406: TR1.7 23.98,66.52 27.3,69.85 27.3,78.11 26.19,79.22 TR1.10
  Bottom 0.406: D3.A 21.27,70.48 20.64,71.12 20.64,73.03 | 20.64,73.03 20.64,73.98 | 20.64,73.98 20.64,78.11 21.75,79.22 TR1.10 | 20.6,74.02 20.64,73.98 | D5.C 18.53,73.03 20.64,73.03
N$40  (via drill 0.4)
  Top 0.305: v38.1,26.35 37.78,26.04 R18.2 R22.1
  Bottom 0.305: IC3.6 v38.1,26.35 38.1,27.3 37.78,27.62 R19.1
N$41  (via drill 0.4)
  Top 0.305: SJ4.1 5.21,11.94 5.71,11.43 v5.71,10.79
  Bottom 0.305: C25.1 8.02,3.73 7.89,3.86 IC4.3 6.35,6.03 5.71,6.67 v5.71,10.79 5.71,11.43 5.21,11.94 SJ4.1
N$42  (via drill 0.4)
  Top 0.305: v5.71,2.86 R14.2 LED1.C
  Bottom 0.305: R14.2 v5.71,2.86
N$43  (via drill 0.4)
  Top 0.305: v45.09,2.86 R15.2 LED2.C
  Bottom 0.305: R15.2 v45.09,2.86
N$44  (via drill 0.4)
  Top 0.305: v5.08,51.44 8.79,51.44 arc90 LED4.C
  Bottom 0.305: v5.08,51.44 v5.08,51.43 R17.2
N$45
  Top 0.406: TR1.6 21.75,59.21 20.64,60.33 20.64,68.58 23.98,71.92 TR1.9
  Bottom 0.406: D4.A 21.27,67.94 20.64,67.31 20.64,64.77 | 20.64,64.77 20.64,64.14 | 20.64,64.14 20.64,60.33 21.75,59.21 TR1.6 | 20.6,64.1 20.64,64.14 | D6.C 18.62,64.77 20.64,64.77
N$46
  Top 0.406: R9.2 Q1.2
N$47
  Top 0.406: Q1.3 53.34,56.2 53.98,55.56 OK5.2
N$49
  Bottom 0.305: C3.2 34.05,59.77 33.84,59.56 D7.A D8.C
NEUTRAL  (via drill 0.4)
  Top 0.406: WA_BOILER.2 55.88,76.83 53.02,73.98 D10.C 50.95,71.9 v49.53,70.48
  Bottom 0.406: C26.2 53.02,66.99 v49.53,70.48
  Bottom 1.27: 55.88,84.45 71.08,84.45 | 71.08,84.45 81.24,84.45 | 81.24,84.45 90.17,84.45 91.44,83.19 MAINS.2 | WA_BOILER.2 55.88,84.45 | 55.88,84.45 45.68,84.45 | 45.68,84.45 10.16,84.45 8.89,83.19 8.89,79.22 | ST_BOILER.1 71.08,84.45 | PUMP.1 81.24,84.45 | SOLENOID.1 45.68,84.45 | TR1.1 8.89,79.22 | TR1.4 8.89,64.22 8.89,79.22
PUMP
  Bottom 1.27: PUMP.2 76.24,75.53 86.36,65.41 86.36,55.24 87.63,53.98 T3.T1
SOLENOID
  Bottom 1.27: SOLENOID.2 40.68,77.43 43.81,74.3 50.8,74.3 58.1,66.67 58.1,59.37 61.59,55.88 T4.T1
ST_ELEMENT
  Bottom 1.27: ST_BOILER.2 66.08,75.84 68.9,73.03 72.71,73.03 83.19,62.55 83.19,49.53 94.61,38.1 T5.T1
V+  (via drill 0.4)
  Top 0.406: ARDUINO.15 25.08,10.16 v24.45,10.79 | v28.57,61.59 28.57,65.09 32.7,69.22 39.37,69.22 C1.+
  Bottom 0.406: v24.45,10.79 24.77,11.11 24.77,36.83 25.4,37.47 25.4,46.67 28.57,49.85 v28.57,61.59 | D3.C 24.88,69.22 | 24.88,69.22 D4.C | C1.+ 39.37,69.22 24.88,69.22
VDD  (via drill 0.4)
  Top 0.305: v23.5,47.62 32.38,47.62 | 32.38,47.62 v33.97,47.62 | IC1.5 v32.38,64.77 32.38,62.23 | 32.38,62.23 32.38,47.62 | D9.C 32.26,62.36 32.38,62.23
  Bottom 0.305: v33.97,47.62 35.56,46.04 35.56,34.37 C12.1 35.56,34.21 IC3.4 | SG1.+ 18.73,23.81 POWER.VDD 20.32,27.94 20.32,32.38 21.91,33.97 21.91,34.61 23.18,35.88 23.18,37.78 24.13,38.73 24.13,46.99 v23.5,47.62 | C5.1 v32.38,64.77
VSS  (via drill 0.4)
  Top 0.305: v21.59,13.97 21.59,8.57 24.77,5.4 v34.29,5.4 | v31.11,48.9 v25.72,48.9
  Bottom 0.305: IC3.11 C13.1 34.85,8.49 34.29,7.94 v34.29,5.4 | v21.59,13.97 POWER.VSS 23.5,23.5 23.5,31.75 22.86,32.38 22.86,34.29 24.13,35.56 24.13,37.47 24.77,38.1 24.77,47.94 v25.72,48.9 | D8.A 36.64,53.15 36.12,52.63 C4.1 36.12,49.77 35.24,48.9 v31.11,48.9
WA_ELEMENT1
  Bottom 1.27: T1.T1 80.64,45.72 79.38,46.99 79.38,60.33 70.48,69.22 67.31,69.22 60.88,75.64 WA_BOILER.1
WA_ELEMENT2
  Bottom 1.27: T2.T1 66.67,36.83 69.22,39.37 73.03,39.37 74.93,41.27 74.93,57.78 66.04,66.67 64.14,66.67 54.29,76.52 53.66,76.52 50.88,79.3 WA_BOILER.3

### Text on the board
tNames: N | N | N | N | L | N | E | Hot Metal Brewbot rev 2.0 / http://tomblog.firstsolo.net